# EAGLE design VProbe (EAGLE 6.6.0)
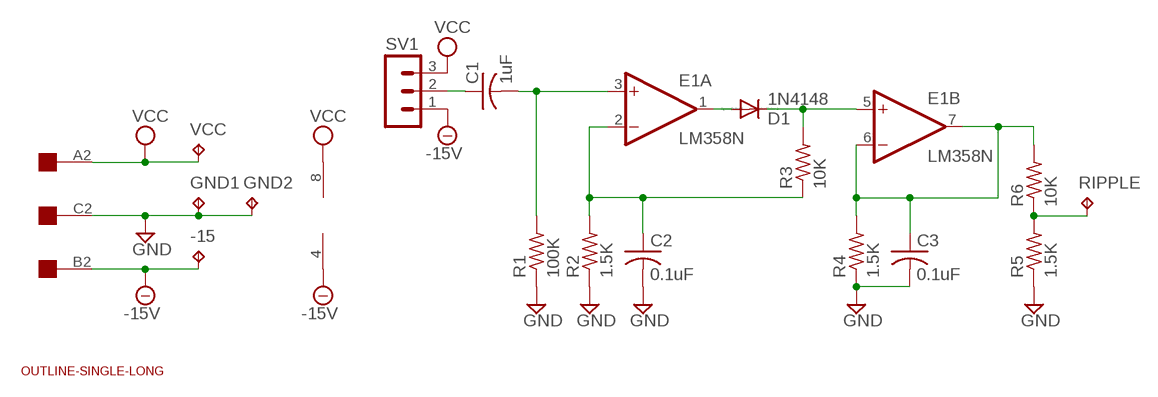
[diagram p0: schematic, sheet 1]

## Parts
-15  TPPAD1-13  [P1-13]
C1  1uF  C-US075-032X103  [C075-032X103]
C2  0.1uF  C-US075-032X103  [C075-032X103]
C3  0.1uF  C-US075-032X103  [C075-032X103]
D1  1N4148  DIODE-DO35-10  [DO35-10]
E1  LM358N  [DIL08]
GND1  TPPAD1-13  [P1-13]
GND2  TPPAD1-13  [P1-13]
R1  100K  R-US_0207/10  [0207/10]
R2  1.5K  R-US_0207/10  [0207/10]
R3  10K  R-US_0207/10  [0207/10]
R4  1.5K  R-US_0207/10  [0207/10]
R5  1.5K  R-US_0207/10  [0207/10]
R6  10K  R-US_0207/10  [0207/10]
RIPPLE  TPPAD1-13  [P1-13]
SV1  MA03-1  [MA03-1]
U$1  EDGE-1  [EDGE-CON1]
U$2  OUTLINE-SINGLE-LONG  [SINGLE-LONG]
VCC  TPPAD1-13  [P1-13]

## Nets
-15V: -15.TP E1.4(P:V-) SV1.1 U$1.B2
GND: C2.2 C3.2 GND1.TP GND2.TP R1.1 R2.1 R4.1 R5.1 U$1.C2
N$1: C1.2 E1.3(A:+IN) R1.2
N$2: D1.A E1.1(A:OUT)
N$3: C2.1 E1.2(A:-IN) R2.2 R3.1
N$4: C3.1 E1.6(B:-IN) E1.7(B:OUT) R4.2 R6.2
N$5: D1.C E1.5(B:+IN) R3.2
N$6: R5.2 R6.1 RIPPLE.TP
N$7: C1.1 SV1.2
VCC: E1.8(P:V+) SV1.3 U$1.A2 VCC.TP
Unconnected: U$1.D2 U$1.E2 U$1.F2 U$1.H2 U$1.J2 U$1.K2 U$1.L2 U$1.M2 U$1.N2 U$1.P2 U$1.R2 U$1.S2 U$1.T2 U$1.U2 U$1.V2

## Library data of the parts
-15 GND1 GND2 RIPPLE VCC = testpad:TP: Test pad
C1-C3 = rcl:C-US: CAPACITOR, American symbol
D1 = diode:DIODE-: DIODE
E1 = linear:LM358: OP AMP also LM158; LM258; LM2904 Source: http://cache.national.com/ds/LM/LM158.pdf
R1-R6 = rcl:R-US_: RESISTOR, American symbol
SV1 = con-lstb:MA03-1: PIN HEADER; OC_FARNELL: unknown; OC_NEWARK: unknown
U$1 = dec-con:EDGE-1: Single-Sided DEC Edge Connector -- (side 2)
U$2 = dec-con:OUTLINE-*: Board outlines for DEC boards.

## Board
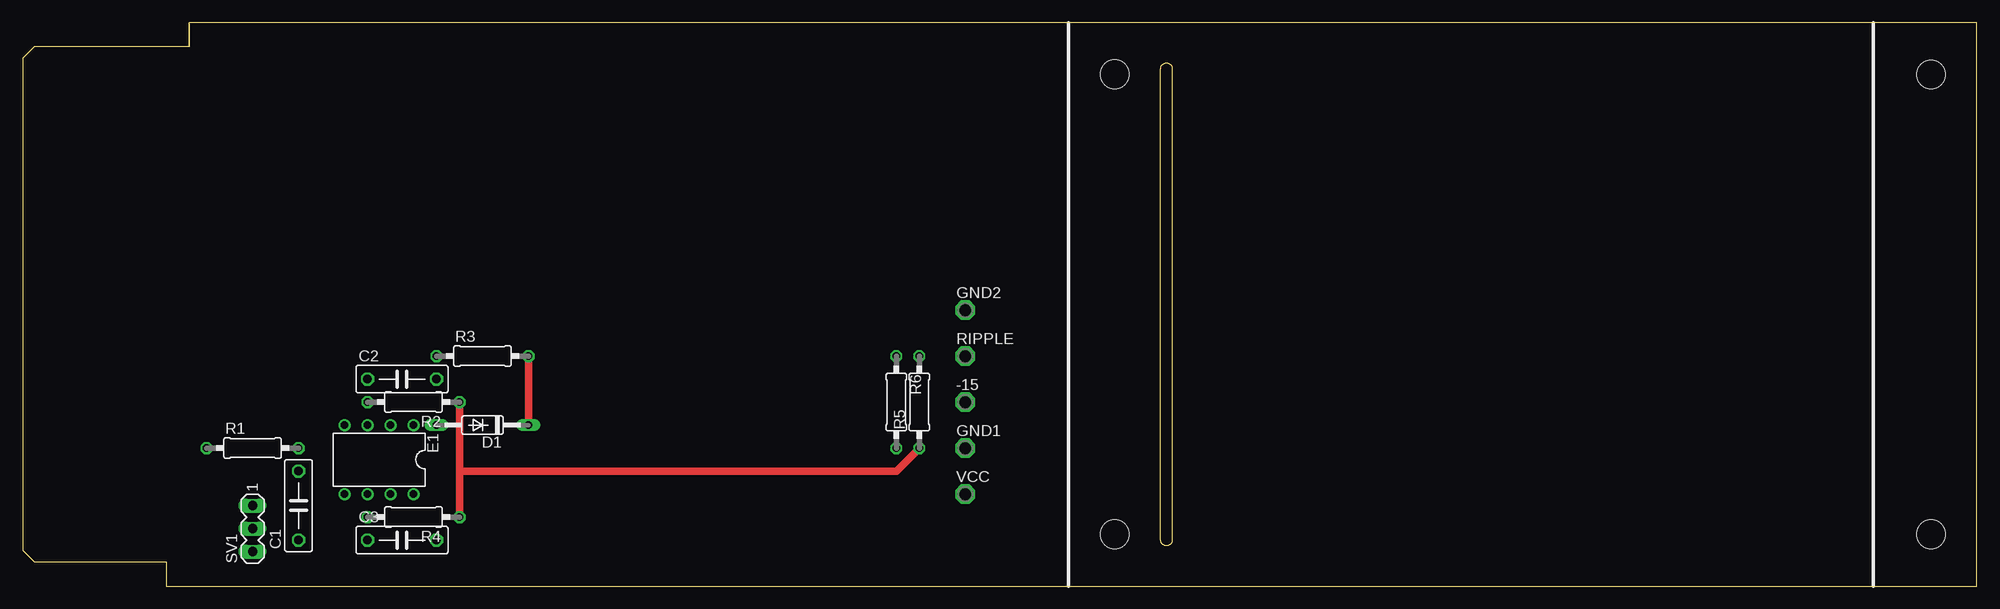
[diagram p1: board, top side]
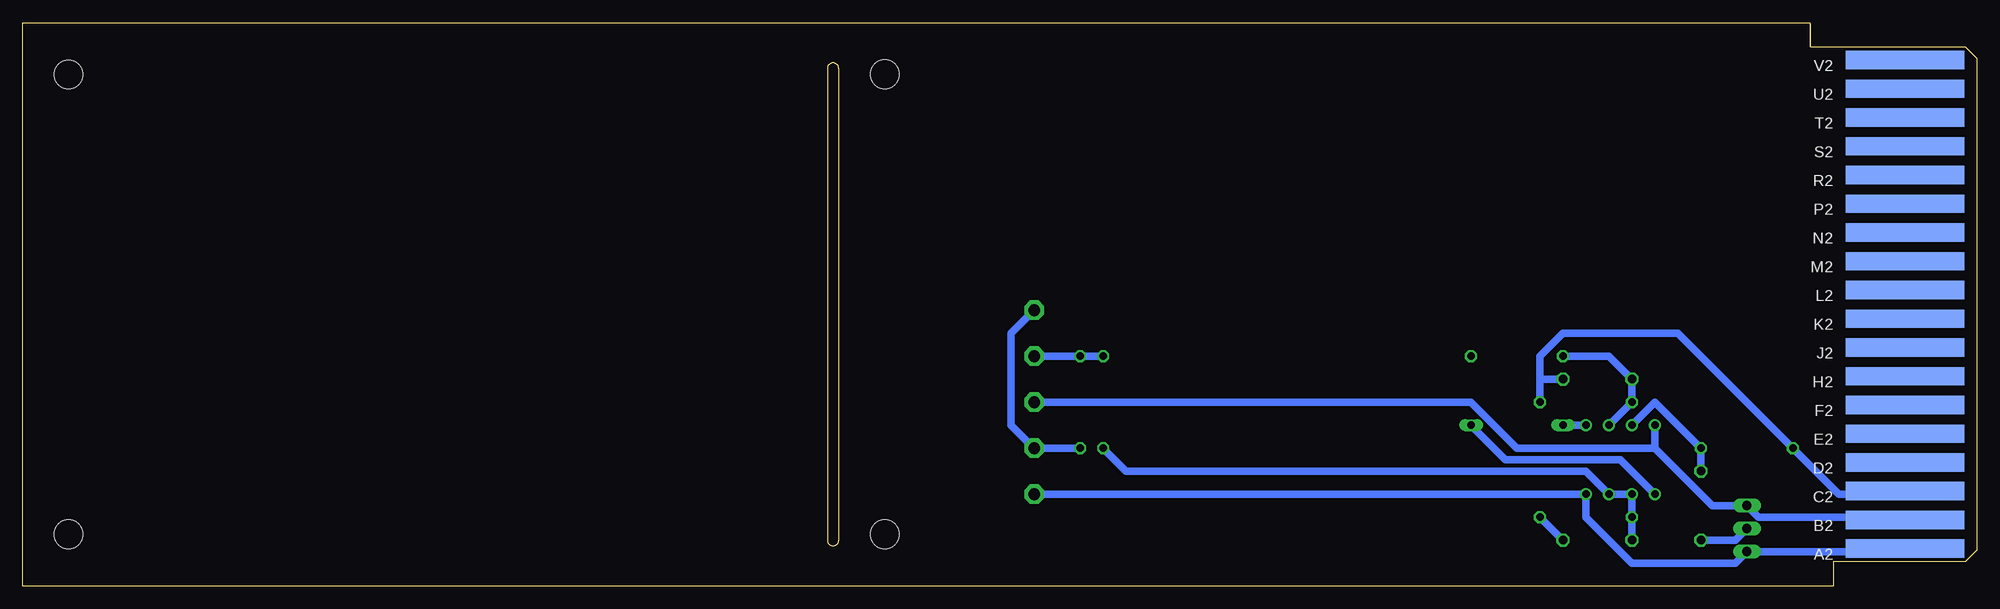
[diagram p2: board, bottom side, seen from below]

Size 215.9 x 62.23 mm. Coordinates in mm from the lower left corner, seen from the top.
Outline: 125.73,5.08 125.73,57.15 arc-180 127,57.15 127,5.08 arc-180 125.73,5.08
Copper layers (1+16): Top 0.035mm / dielectric 1.5mm / Bottom 0.035mm
Design rules "16mils": minimum track width 16mil, minimum drill 32mil, track to track 15mil, track to pad 10mil, pad to pad 10mil, via to via 10mil, smd to smd 10mil, copper to edge 13mil, drill to drill 10mil, minimum pad ring 10mil, minimum via ring 8mil, stop-mask expansion 0mil, vias tented up to drill 0mil, thermal gap 10mil
Holes 3.2 mm at 120.65,56.52 120.65,5.71

### Footprints (pad centres in the part's own frame; a part is rotated, then mirrored left to right if it is on the bottom)
P1-13 = drill 1.321 pad 2.159 octagon: TP 0,0
C075-032X103 = drill 0.914 octagon: 1 -3.81,0; 2 3.81,0
DO35-10 = drill 0.813 long: A 5.08,0; C -5.08,0
DIL08 = drill 0.813 pad 1.27: 1 -3.81,-3.81; 2 -1.27,-3.81; 3 1.27,-3.81; 4 3.81,-3.81; 5 3.81,3.81; 6 1.27,3.81; 7 -1.27,3.81; 8 -3.81,3.81
0207/10 = drill 0.813 octagon: 1 -5.08,0; 2 5.08,0
MA03-1 = drill 1.016 long: 1 -2.54,0; 2 0,0; 3 2.54,0
EDGE-CON1 = smd 13.106 x 2.032 bottom: A2 7.938,4.128; B2 7.938,7.303; C2 7.938,10.477; D2 7.938,13.652; E2 7.938,16.828; F2 7.938,20.003; H2 7.938,23.177; J2 7.938,26.352; K2 7.938,29.527; L2 7.938,32.703; M2 7.938,35.877; N2 7.938,39.053; P2 7.938,42.227; R2 7.938,45.403; S2 7.938,48.578; T2 7.938,51.752; U2 7.938,54.928; V2 7.938,58.102
SINGLE-LONG = hole 3.175: 210.82,56.515; 210.82,5.715

### Placement (x,y rotation side)
-15  104.14,20.32 0 top
C1  30.48,8.89 90 top
C2  41.91,22.86 0 top
C3  41.91,5.08 0 top
D1  50.8,17.78 180 top
E1  39.37,13.97 180 top
GND1  104.14,15.24 0 top
GND2  104.14,30.48 0 top
R1  25.4,15.24 0 top
R2  43.18,20.32 180 top
R3  50.8,25.4 0 top
R4  43.18,7.62 180 top
R5  99.06,20.32 90 top
R6  96.52,20.32 270 top
RIPPLE  104.14,25.4 0 top
SV1  25.4,6.35 270 top
U$1  0,0 0 top
U$2  0,0 0 top
VCC  104.14,10.16 0 top

### Tracks (layer width: path | path; a pad name or v marks a point on that pad's centre or on a via)
-15V
  Bottom 0.813: U$1.B2 9.84,7.3 10.16,7.62 24.13,7.62 SV1.1 29.21,8.89 35.56,15.24 | E1.4 35.56,15.24 | 35.56,15.24 50.8,15.24 55.88,20.32 -15.TP
GND
  Top 0.813: R2.1 48.26,12.7 | 48.26,12.7 R4.1 | R5.1 96.52,12.7 48.26,12.7
  Bottom 0.813: C2.2 48.26,22.86 R2.1 48.26,25.4 45.72,27.94 33.02,27.94 R1.1 15.24,10.16 8.89,10.16 8.57,10.48 U$1.C2 | C3.2 R4.1 | R5.1 GND1.TP 106.68,17.78 106.68,27.94 GND2.TP
N$1
  Bottom 0.813: C1.2 R1.2 35.56,20.32 E1.3
N$2
  Bottom 0.813: E1.1 D1.A
N$3
  Bottom 0.813: E1.2 R2.2 C2.1 40.64,25.4 R3.1
N$4
  Bottom 0.813: C3.1 R4.2 E1.6 E1.7 43.18,12.7 93.98,12.7 R6.2
N$5
  Top 0.813: R3.2 D1.C
  Bottom 0.813: E1.5 39.37,13.97 52.07,13.97 D1.C
N$6
  Bottom 0.813: RIPPLE.TP R5.2 R6.1
N$7
  Bottom 0.813: SV1.2 26.67,5.08 C1.1
VCC
  Bottom 0.813: U$1.A2 8.57,4.13 8.89,3.81 SV1.3 26.67,2.54 38.1,2.54 43.18,7.62 E1.8 VCC.TP